# EAGLE design Extension board R.Pi ver. 1.00 (EAGLE 6.1)
Master board. Prototype version 1.0
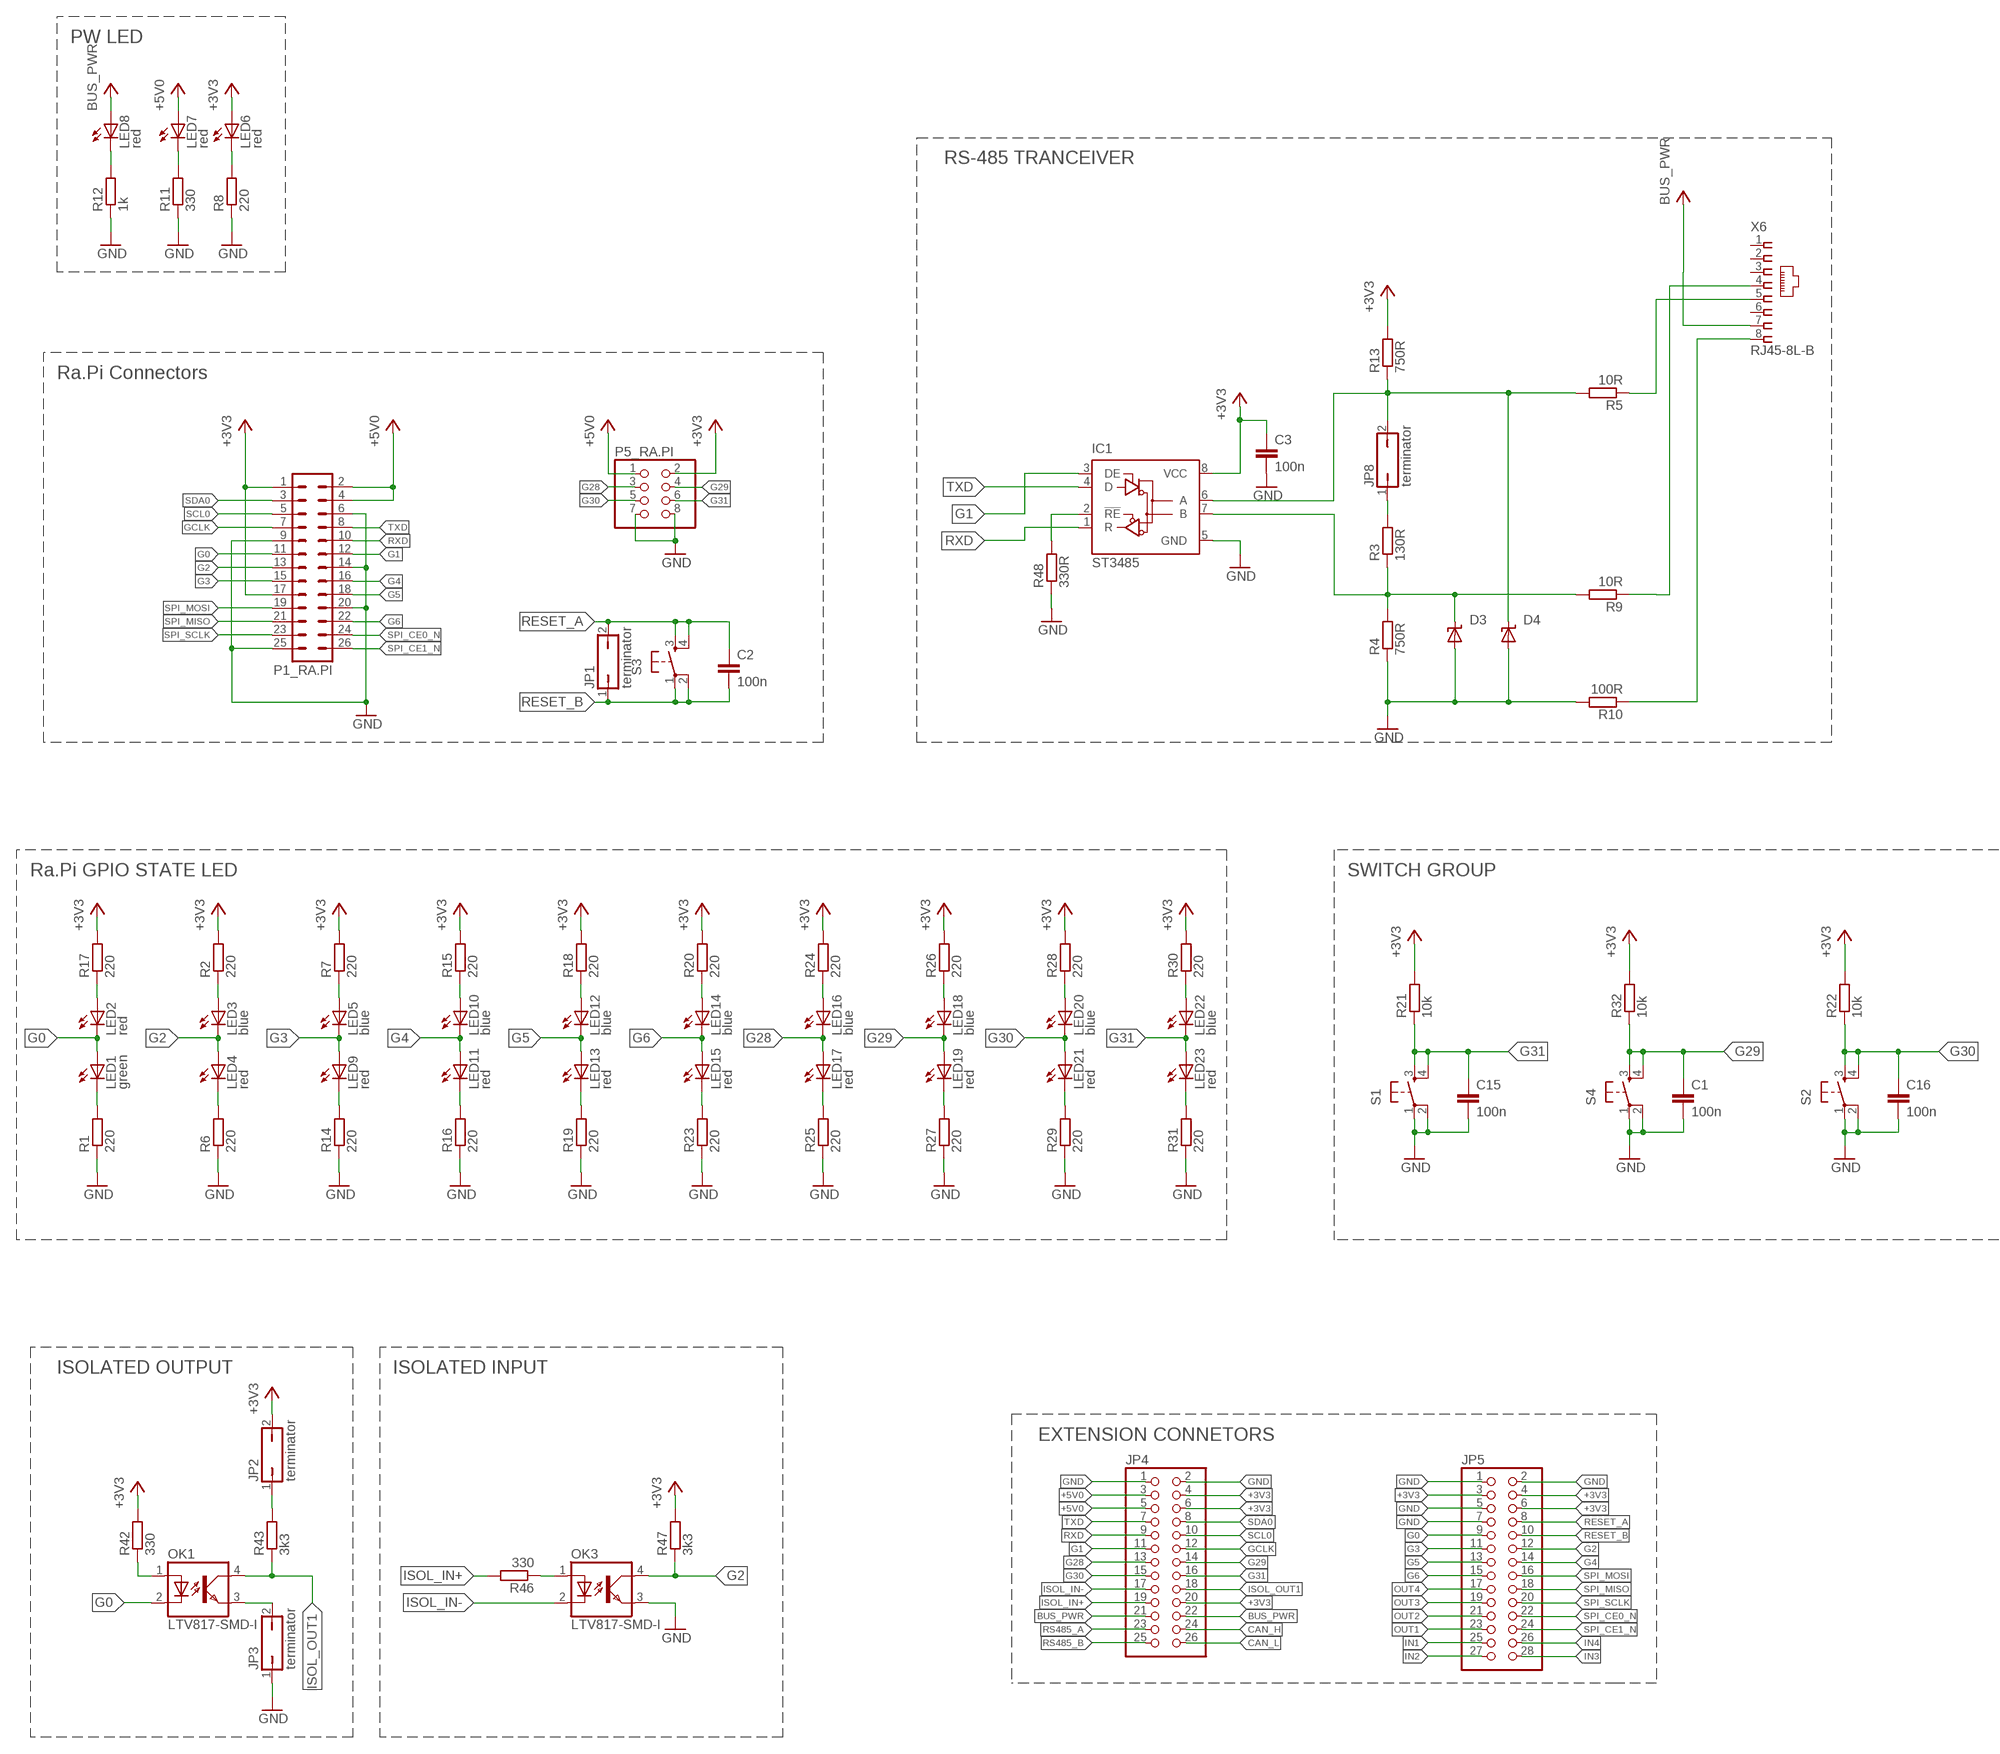
[diagram p0: schematic, sheet 1, part 1 of 2]
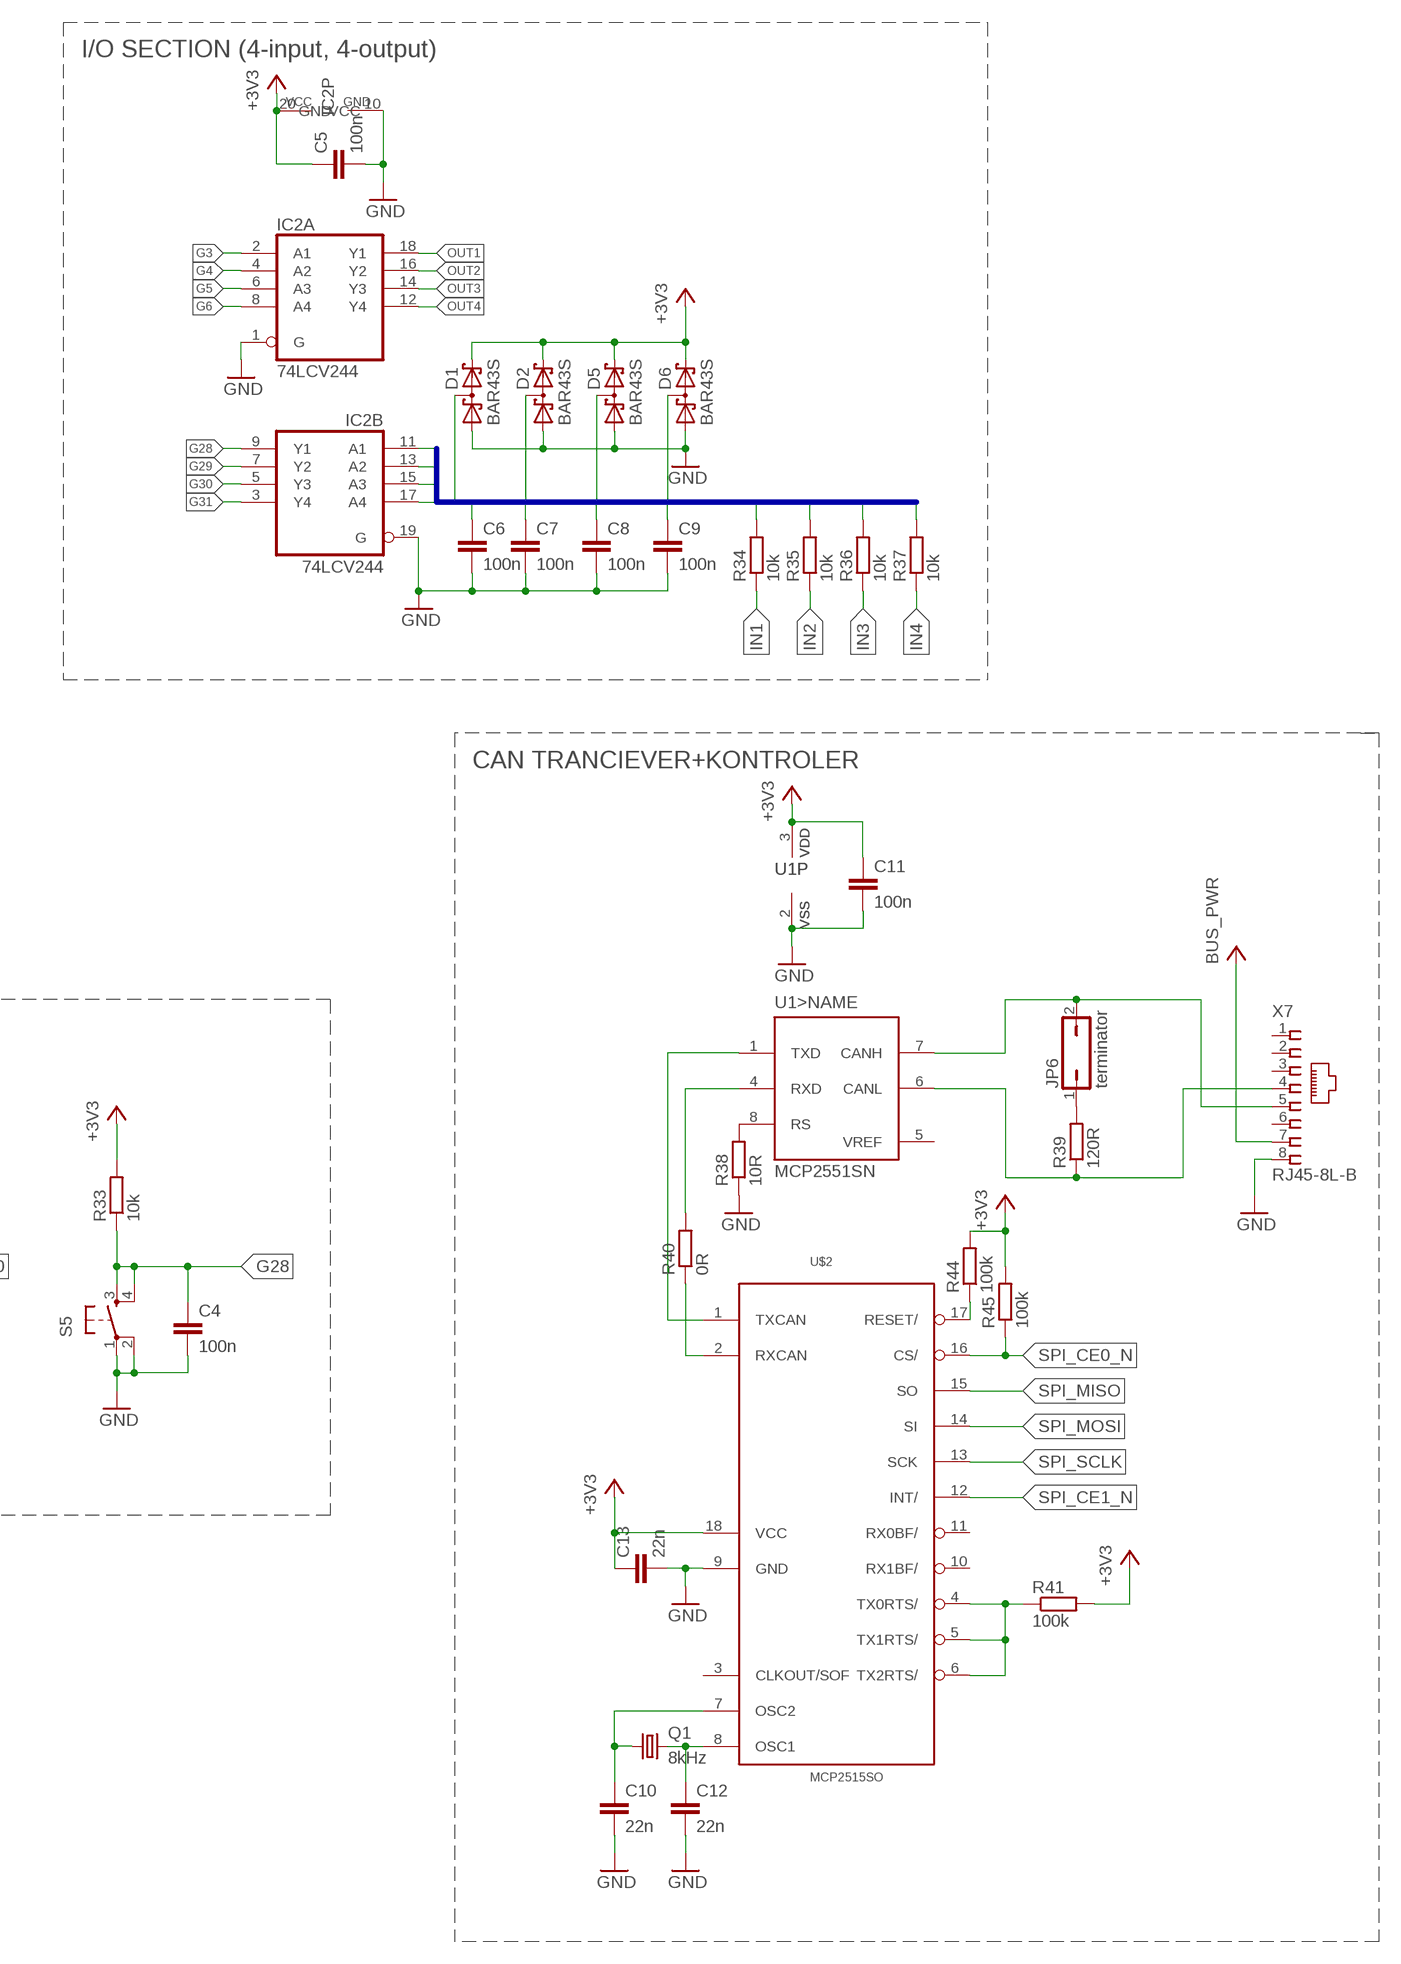
[diagram p1: schematic, sheet 1, part 2 of 2]

## Parts
C1  100n  C-EUC0805  [C0805]
C2  100n  C-EUC0805  [C0805]
C3  100n  C-EUC0805  [C0805]
C4  100n  C-EUC0805  [C0805]
C5  100n  C-EUC0805  [C0805]
C6  100n  C-EUC0805  [C0805]
C7  100n  C-EUC0805  [C0805]
C8  100n  C-EUC0805  [C0805]
C9  100n  C-EUC0805  [C0805]
C10  22n  C-EUC0805  [C0805]
C11  100n  C-EUC0805  [C0805]
C12  22n  C-EUC0805  [C0805]
C13  22n  C-EUC0805  [C0805]
C15  100n  C-EUC0805  [C0805]
C16  100n  C-EUC0805  [C0805]
D1  BAR43S  BAT54S  [SOT23]
D2  BAR43S  BAT54S  [SOT23]
D3  SUPPRESSOR-SMBJ  [SMBJ]
D4  SUPPRESSOR-SMBJ  [SMBJ]
D5  BAR43S  BAT54S  [SOT23]
D6  BAR43S  BAT54S  [SOT23]
IC1  ST3485  75176AD  [D_R-PDSO-G8]
IC2  74LCV244  74244TSSOP  [TSSOP20]
JP1  terminator  JP1Q  [JP1]
JP2  terminator  JP1Q  [JP1]
JP3  terminator  JP1Q  [JP1]
JP4  PINHD-2X13  [2X13]
JP5  PINHD-2X14  [2X14]
JP6  terminator  JP1Q  [JP1]
JP8  terminator  JP1Q  [JP1]
LED1  green  LEDSML0805  [SML0805]
LED2  red  LEDSML0805  [SML0805]
LED3  blue  LEDSML0805  [SML0805]
LED4  red  LEDSML0805  [SML0805]
LED5  blue  LEDSML0805  [SML0805]
LED6  red  LEDSML0805  [SML0805]
LED7  red  LEDSML0805  [SML0805]
LED8  red  LEDSML0805  [SML0805]
LED9  red  LEDSML0805  [SML0805]
LED10  blue  LEDSML0805  [SML0805]
LED11  red  LEDSML0805  [SML0805]
LED12  blue  LEDSML0805  [SML0805]
LED13  red  LEDSML0805  [SML0805]
LED14  blue  LEDSML0805  [SML0805]
LED15  red  LEDSML0805  [SML0805]
LED16  blue  LEDSML0805  [SML0805]
LED17  red  LEDSML0805  [SML0805]
LED18  blue  LEDSML0805  [SML0805]
LED19  red  LEDSML0805  [SML0805]
LED20  blue  LEDSML0805  [SML0805]
LED21  red  LEDSML0805  [SML0805]
LED22  blue  LEDSML0805  [SML0805]
LED23  red  LEDSML0805  [SML0805]
OK1  LTV817-SMD-I  LTV816S  [SMD4]
OK3  LTV817-SMD-I  LTV816S  [SMD4]
P1_RA.PI  MA13-2  [MA13-2]
P5_RA.PI  PINHD-2X4  [2X04]
Q1  8kHz  CRYSTALHC49UP  [HC49UP]
R1  220  R-EU_M0805  [M0805]
R2  220  R-EU_M0805  [M0805]
R3  130R  R-EU_M0805  [M0805]
R4  750R  R-EU_M0805  [M0805]
R5  10R  R-EU_M0805  [M0805]
R6  220  R-EU_M0805  [M0805]
R7  220  R-EU_M0805  [M0805]
R8  220  R-EU_M0805  [M0805]
R9  10R  R-EU_M0805  [M0805]
R10  100R  R-EU_M0805  [M0805]
R11  330  R-EU_M0805  [M0805]
R12  1k  R-EU_M0805  [M0805]
R13  750R  R-EU_M0805  [M0805]
R14  220  R-EU_M0805  [M0805]
R15  220  R-EU_M0805  [M0805]
R16  220  R-EU_M0805  [M0805]
R17  220  R-EU_M0805  [M0805]
R18  220  R-EU_M0805  [M0805]
R19  220  R-EU_M0805  [M0805]
R20  220  R-EU_M0805  [M0805]
R21  10k  R-EU_M0805  [M0805]
R22  10k  R-EU_M0805  [M0805]
R23  220  R-EU_M0805  [M0805]
R24  220  R-EU_M0805  [M0805]
R25  220  R-EU_M0805  [M0805]
R26  220  R-EU_M0805  [M0805]
R27  220  R-EU_M0805  [M0805]
R28  220  R-EU_M0805  [M0805]
R29  220  R-EU_M0805  [M0805]
R30  220  R-EU_M0805  [M0805]
R31  220  R-EU_M0805  [M0805]
R32  10k  R-EU_M0805  [M0805]
R33  10k  R-EU_M0805  [M0805]
R34  10k  R-EU_M0805  [M0805]
R35  10k  R-EU_M0805  [M0805]
R36  10k  R-EU_M0805  [M0805]
R37  10k  R-EU_M0805  [M0805]
R38  10R  R-EU_M0805  [M0805]
R39  120R  R-EU_M0805  [M0805]
R40  0R  R-EU_M0805  [M0805]
R41  100k  R-EU_M0805  [M0805]
R42  330  R-EU_M0805  [M0805]
R43  3k3  R-EU_M0805  [M0805]
R44  100k  R-EU_M0805  [M0805]
R45  100k  R-EU_M0805  [M0805]
R46  330  R-EU_M0805  [M0805]
R47  3k3  R-EU_M0805  [M0805]
R48  330R  R-EU_M0805  [M0805]
S1  SPARKFUN_TAC_SWITCHSMD  [SPARKFUN_TACTILE_SWITCH_SMD]
S2  SPARKFUN_TAC_SWITCHSMD  [SPARKFUN_TACTILE_SWITCH_SMD]
S3  SPARKFUN_TAC_SWITCHSMD  [SPARKFUN_TACTILE_SWITCH_SMD]
S4  SPARKFUN_TAC_SWITCHSMD  [SPARKFUN_TACTILE_SWITCH_SMD]
S5  SPARKFUN_TAC_SWITCHSMD  [SPARKFUN_TACTILE_SWITCH_SMD]
U1  MCP2551SN  [SO-08]
U$2  MCP2515SO  [SO18L]
X6  RJ45-8L-B  [RJ45-NO-SHIELD]
X7  RJ45-8L-B  [RJ45-NO-SHIELD]

## Nets
+3V3: C3.1 C5.1 C11.1 C13.1 D1.2(C2) D2.2(C2) D5.2(C2) D6.2(C2) IC1.8(VCC) IC2.20(P:VCC) JP2.2 JP4.4 JP4.6 JP4.20 JP5.3 JP5.4 JP5.6 LED6.A P1_RA.PI.1 P1_RA.PI.17 P5_RA.PI.2 R2.2 R7.2 R13.2 R15.2 R17.2 R18.2 R20.2 R21.2 R22.2 R24.2 R26.2 R28.2 R30.2 R32.2 R33.2 R41.2 R42.2 R44.2 R45.2 R47.2 U1.3(P:VDD) U$2.18(VCC)
+5V0: JP4.3 JP4.5 LED7.A P1_RA.PI.2 P1_RA.PI.4 P5_RA.PI.1
BUS_PWR: JP4.21 JP4.22 LED8.A X6.7 X7.7
CAN_H: JP4.24 JP6.2 U1.7(>NAME:CANH) X7.5
CAN_L: JP4.26 R39.1 U1.6(>NAME:CANL) X7.4
G0: JP5.9 LED1.A LED2.C OK1.2(C) P1_RA.PI.11
G1: IC1.3(DE) JP4.11 P1_RA.PI.12
G2: JP5.12 LED3.C LED4.A OK3.4(COL) P1_RA.PI.13 R47.1
G3: IC2.2(A:A1) JP5.11 LED5.C LED9.A P1_RA.PI.15
G4: IC2.4(A:A2) JP5.14 LED10.C LED11.A P1_RA.PI.16
G5: IC2.6(A:A3) JP5.13 LED12.C LED13.A P1_RA.PI.18
G6: IC2.8(A:A4) JP5.15 LED14.C LED15.A P1_RA.PI.22
G28: C4.1 IC2.9(B:Y1) JP4.13 LED16.C LED17.A P5_RA.PI.3 R33.1 S5.3 S5.4
G29: C1.1 IC2.7(B:Y2) JP4.14 LED18.C LED19.A P5_RA.PI.4 R32.1 S4.3 S4.4
G30: C16.1 IC2.5(B:Y3) JP4.15 LED20.C LED21.A P5_RA.PI.5 R22.1 S2.3 S2.4
G31: C15.1 IC2.3(B:Y4) JP4.16 LED22.C LED23.A P5_RA.PI.6 R21.1 S1.3 S1.4
GCLK: JP4.12 P1_RA.PI.7
GND: C1.2 C3.2 C4.2 C5.2 C6.2 C7.2 C8.2 C9.2 C10.2 C11.2 C12.2 C13.2 C15.2 C16.2 D1.1(A1) D2.1(A1) D3.A D4.A D5.1(A1) D6.1(A1) IC1.5(GND) IC2.1(A:G) IC2.10(P:GND) IC2.19(B:G) JP3.1 JP4.1 JP4.2 JP5.1 JP5.2 JP5.5 JP5.7 OK3.3(EMIT) P1_RA.PI.6 P1_RA.PI.9 P1_RA.PI.14 P1_RA.PI.20 P1_RA.PI.25 P5_RA.PI.7 P5_RA.PI.8 R1.1 R4.1 R6.1 R8.1 R10.2 R11.1 R12.1 R14.1 R16.1 R19.1 R23.1 R25.1 R27.1 R29.1 R31.1 R38.1 R48.1 S1.1 S1.2 S2.1 S2.2 S4.1 S4.2 S5.1 S5.2 U1.2(P:VSS) U$2.9(GND) X7.8
GND_RS485: R10.1 X6.8
IN1: JP5.25 R34.1
IN2: JP5.27 R35.1
IN3: JP5.28 R36.1
IN4: JP5.26 R37.1
IN_1: C6.1 D1.3(C1A2) IC2.11(B:A1) R34.2
IN_2: C7.1 D2.3(C1A2) IC2.13(B:A2) R35.2
IN_3: C8.1 D5.3(C1A2) IC2.15(B:A3) R36.2
IN_4: C9.1 D6.3(C1A2) IC2.17(B:A4) R37.2
ISOL_IN+: JP4.19 R46.2
ISOL_IN-: JP4.17 OK3.2(C)
ISOL_OUT1: JP4.18 OK1.4(COL) R43.1
N$1: LED2.A R17.1
N$2: R38.2 U1.8(>NAME:RS)
N$3: R40.1 U$2.2(RXCAN)
N$4: D3.C IC1.7(B) R3.1 R4.2 R9.2
N$5: LED1.C R1.2
N$6: LED6.C R8.2
N$7: LED7.C R11.2
N$8: LED8.C R12.2
N$9: LED3.A R2.1
N$10: LED4.C R6.2
N$11: LED5.A R7.1
N$12: LED9.C R14.2
N$13: LED10.A R15.1
N$14: LED11.C R16.2
N$15: JP8.1 R3.2
N$16: LED12.A R18.1
N$17: LED13.C R19.2
N$18: LED14.A R20.1
N$19: LED15.C R23.2
N$20: LED16.A R24.1
N$21: LED17.C R25.2
N$22: LED18.A R26.1
N$23: LED19.C R27.2
N$24: LED20.A R28.1
N$25: LED21.C R29.2
N$26: LED22.A R30.1
N$27: LED23.C R31.2
N$28: R40.2 U1.4(>NAME:RXD)
N$29: U1.1(>NAME:TXD) U$2.1(TXCAN)
N$30: JP6.1 R39.2
N$31: C12.1 Q1.2 U$2.8(OSC1)
N$32: C10.1 Q1.1 U$2.7(OSC2)
N$33: JP3.2 OK1.3(EMIT)
N$34: OK1.1(A) R42.1
N$35: OK3.1(A) R46.1
N$36: JP2.1 R43.2
N$37: R41.1 U$2.4(TX0RTS/) U$2.5(TX1RTS/) U$2.6(TX2RTS/)
N$38: R44.1 U$2.17(RESET/)
N$39: IC1.2(!RE) R48.2
OUT1: IC2.18(A:Y1) JP5.23
OUT2: IC2.16(A:Y2) JP5.21
OUT3: IC2.14(A:Y3) JP5.19
OUT4: IC2.12(A:Y4) JP5.17
RESET_A: C2.1 JP1.2 JP5.8 S3.3 S3.4
RESET_B: C2.2 JP1.1 JP5.10 S3.1 S3.2
RS485_A: JP4.23 R5.1 X6.5
RS485_A2: D4.C IC1.6(A) JP8.2 R5.2 R13.1
RS485_B: JP4.25 R9.1 X6.4
RXD: IC1.1(R) JP4.9 P1_RA.PI.10
SCL0: JP4.10 P1_RA.PI.5
SDA0: JP4.8 P1_RA.PI.3
SPI_CE0_N: JP5.22 P1_RA.PI.24 R45.1 U$2.16(CS/)
SPI_CE1_N: JP5.24 P1_RA.PI.26 U$2.12(INT/)
SPI_MISO: JP5.18 P1_RA.PI.21 U$2.15(SO)
SPI_MOSI: JP5.16 P1_RA.PI.19 U$2.14(SI)
SPI_SCLK: JP5.20 P1_RA.PI.23 U$2.13(SCK)
TXD: IC1.4(D) JP4.7 P1_RA.PI.8
Unconnected: U$2.3(CLKOUT/SOF) U$2.10(RX1BF/) U$2.11(RX0BF/) X6.1 X6.2 X6.3 X6.6 X7.1 X7.2 X7.3 X7.6

## Buses
IN_1,IN_2,IN_3,IN_4

## Notes on the sheet
- PW LED
- I/O SECTION (4-input, 4-output)
- RS-485 TRANCEIVER
- Ra.Pi Connectors
- CAN TRANCIEVER+KONTROLER
- Ra.Pi GPIO STATE LED | SWITCH GROUP
- ISOLATED OUTPUT | ISOLATED INPUT
- EXTENSION CONNETORS

## Power pins joined to a net without a drawn wire
VREF: U1.5(>NAME:VREF)

## Library data of the parts
C1-C13 C15 C16 = rcl:C-EU: CAPACITOR, European symbol
D1 D2 D5 D6 = diode:BAT54S: Schottky Diodes Pin connection corrected 2011-05-04 Source: Fairchild .. BAT54.pdf
D3 D4 = diode:SUPPRESSOR-: Suppressor diode
IC1 = 751xx:75176A: DIFFERENTIAL BUS TRANSCEIVER Source: http://focus.ti.com/lit/ds/symlink/sn75176a.pdf
IC2 = 74xx-eu:74*244: Octal BUFFER and LINE DRIVER, 3-state
JP1-JP3 JP6 JP8 = jumper:JP1Q: JUMPER
JP4 = pinhead:PINHD-2X13: PIN HEADER
JP5 = pinhead:PINHD-2X14: PIN HEADER
LED1-LED23 = led:LED: LED OSRAM: - CHIPLED LG R971, LG N971, LY N971, LG Q971, LY Q971, LO R971, LY R971 LH N974, LH R974 LS Q976, LO Q976, LY Q976 LO Q996 - Hyper CHIPLED LW Q18S LB Q993, LB Q99A, LB R99A - SideLED LS A670, LO A670, LY A670, LG A670, LP A670 LB A673, LV A673, LT A673, LW A673 LH A674 LY A675 LS A676, LA A676, LO A676, LY A676, LW A676 LS A679, LY A679, LG A679 - Hyper Micro SIDELED® LS Y876, LA Y876, LO Y876, LY Y876 LT Y87S - SmartLED LW L88C, LW L88S LB L89C, LB L89S, LG L890 LS L89K, LO L89K, LY L89K LS L896, LA L896, LO L896, LY L896 - TOPLED LS T670, LO T670, LY T670, LG T670, LP T670 LSG T670, LSP T670, LSY T670, LOP T670, LYG T670 LG T671, LOG T671, LSG T671 LB T673, LV T673, LT T673, LW T673 LH T674 LS T676, LA T676, LO T676, LY T676, LB T676, LH T676, LSB T676, LW T676 LB T67C, LV T67C, LT T67C, LS T67K, LO T67K, LY T67K, LW E67C LS E67B, LA E67B, LO E67B, LY E67B, LB E67C, LV E67C, LT E67C LW T67C LS T679, LY T679, LG T679 LS T770, LO T770, LY T770, LG T770, LP T770 LB T773, LV T773, LT T773, LW T773 LH T774 LS E675, LA E675, LY E675, LS T675 LS T776, LA T776, LO T776, LY T776, LB T776 LHGB T686 LT T68C, LB T68C - Hyper Mini TOPLED® LB M676 - Mini TOPLED Santana® LG M470 LS M47K, LO M47K, LY M47K Source: http://www.osram.convergy.de LUXEON: - LUMILED® LXK2-PW12-R00, LXK2-PW12-S00, LXK2-PW14-U00, LXK2-PW14-V00 LXK2-PM12-R00, LXK2-PM12-S00, LXK2-PM14-U00 LXK2-PE12-Q00, LXK2-PE12-R00, LXK2-PE12-S00, LXK2-PE14-T00, LXK2-PE14-U00 LXK2-PB12-K00, LXK2-PB12-L00, LXK2-PB12-M00, LXK2-PB14-N00, LXK2-PB14-P00, LXK2-PB14-Q00 LXK2-PR12-L00, LXK2-PR12-M00, LXK2-PR14-Q00, LXK2-PR14-R00 LXK2-PD12-Q00, LXK2-PD12-R00, LXK2-PD12-S00 LXK2-PH12-R00, LXK2-PH12-S00 LXK2-PL12-P00, LXK2-PL12-Q00, LXK2-PL12-R00 Source: www.luxeon.com KINGBRIGHT: KA-3528ASYC Source: www.kingbright.com
OK1 OK3 = optocoupler:LTV816: OPTO COUPLER Source: LITEON, LTV816.pdf; OC_FARNELL: unknown; OC_NEWARK: unknown
P1_RA.PI = con-lstb:MA13-2: PIN HEADER; OC_FARNELL: unknown; OC_NEWARK: unknown
P5_RA.PI = pinhead:PINHD-2X4: PIN HEADER
Q1 = crystal:CRYSTAL: CRYSTAL; OC_FARNELL: unknown; OC_NEWARK: unknown
R1-R48 = rcl:R-EU_: RESISTOR, European symbol
S1-S5 = Nokia-Breakout-v14:SPARKFUN_TAC_SWITCH: Momentary Switch Button commonly used for reset or general input. Spark Fun Electronics SKU : COM-00097
U1 = microchip_can:MCP2551: High Speed CAN tranceiver
U$2 = MCP2515_MT:MCP2515*: MCP2515 Standalone CAN-Controller by Microchip Eagle-Lib. by MartinThomas
X6 X7 = con-tycoelectronics:RJ45: CORCOM Modular RJ Jacks No Shield Source: www.tycoelectronics.com .. ENG_DS_1654001_1099_RJ_L_0507.pdf; MF: TYCO ELECTRONICS; MPN: RJ45-8L-B; OC_FARNELL: 1279843; OC_NEWARK: 52K4445

## Board
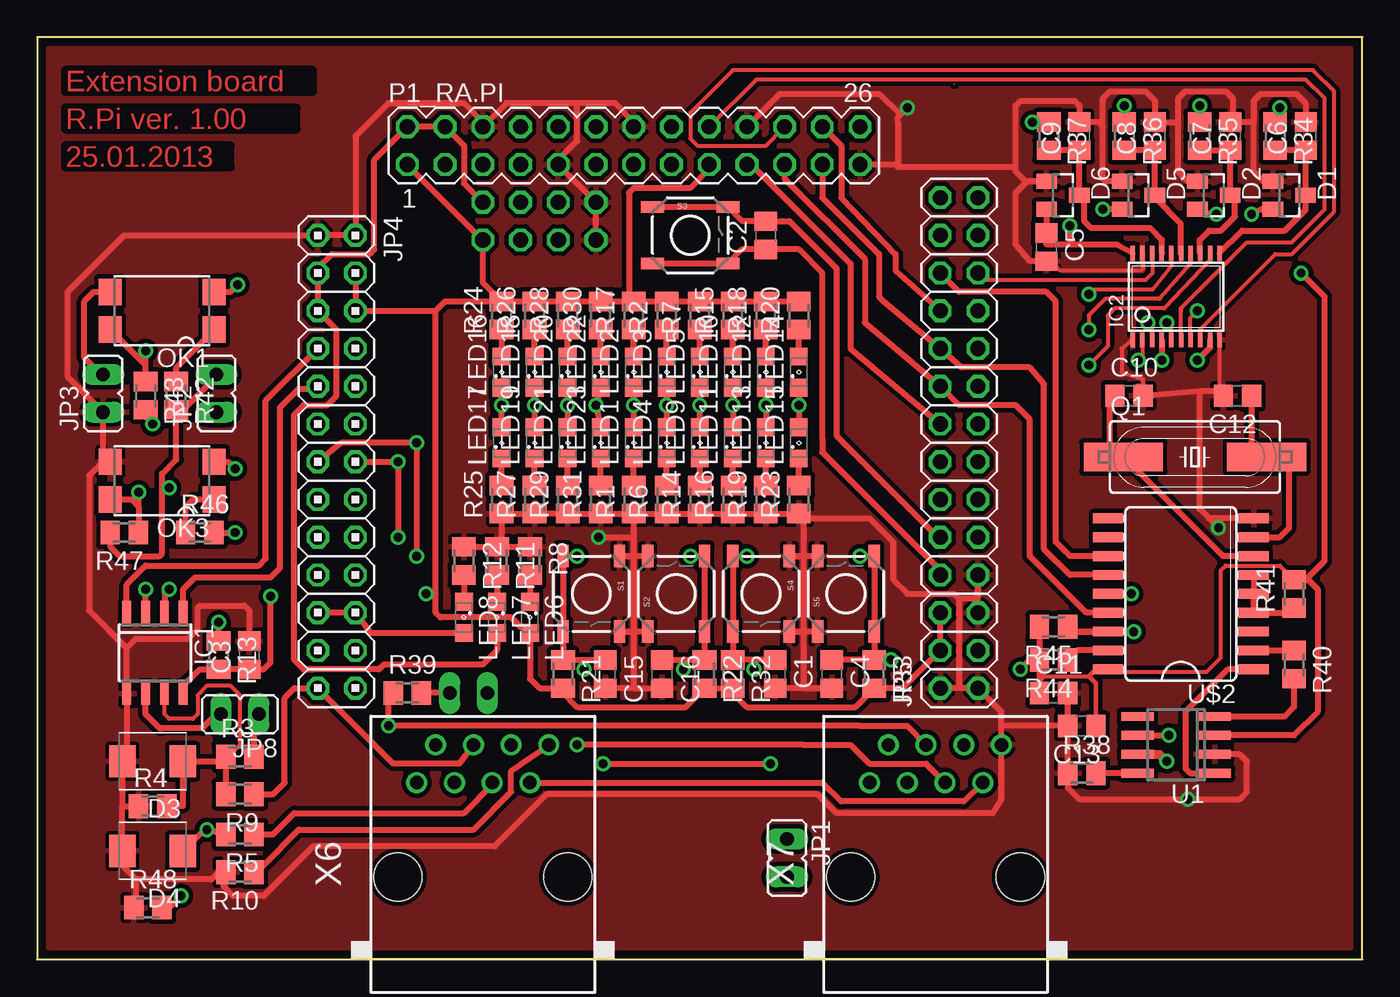
[diagram p2: board, top side]
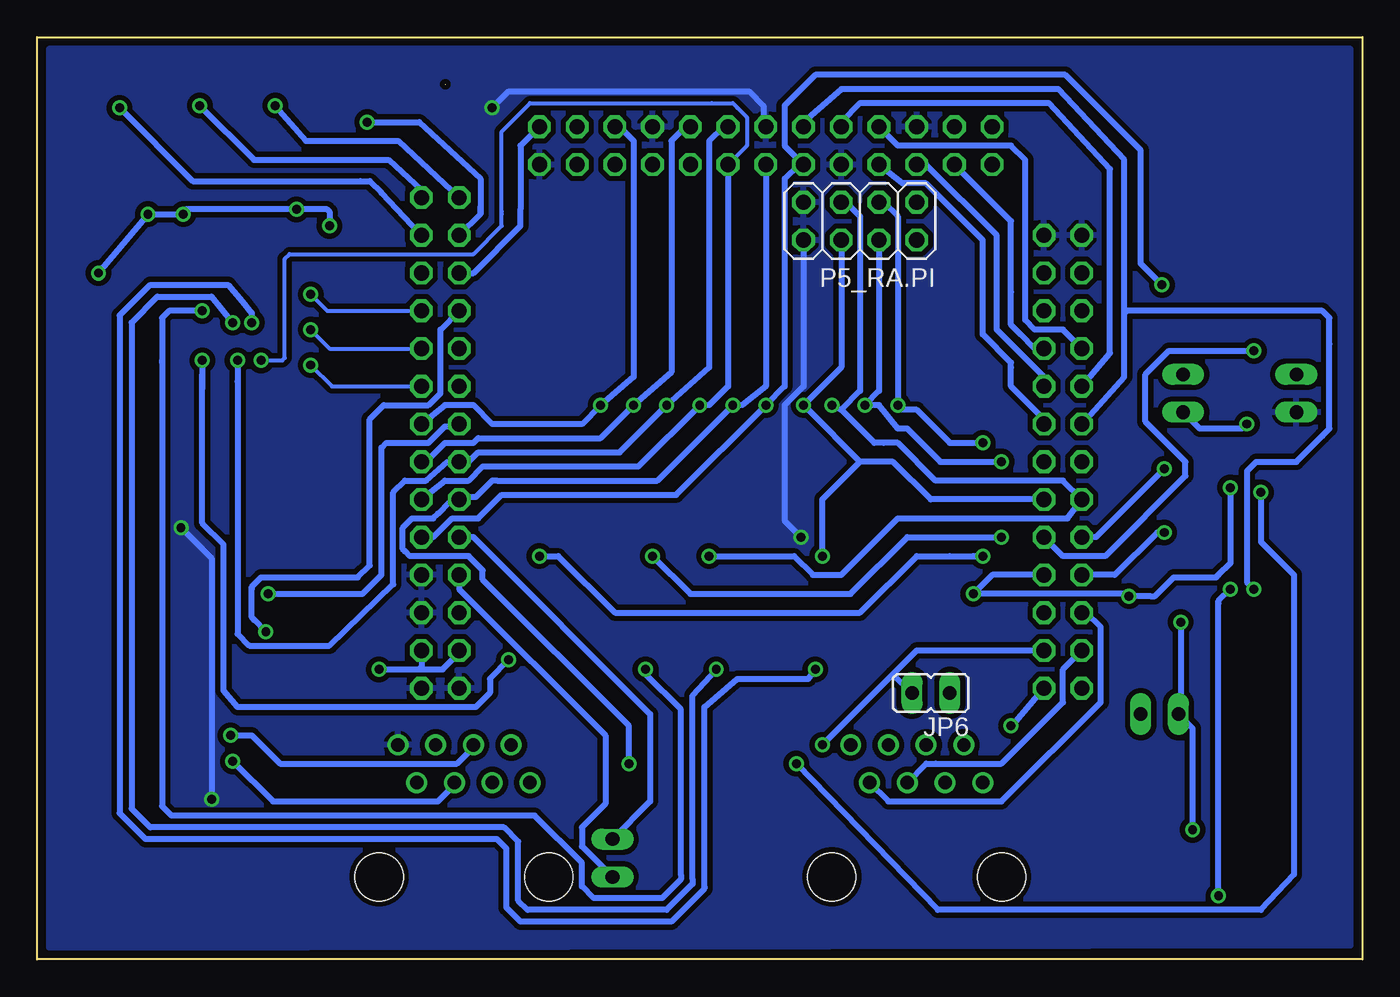
[diagram p3: board, bottom side, seen from below]

Size 89.22 x 62.07 mm. Coordinates in mm from the lower left corner, seen from the top.
Outline: 61.75,58.9 61.73,58.9
Outline: 0,62.07 0,0 89.22,0 89.22,62.07 0,62.07
Copper layers (1*16): Top 0.035mm / dielectric 1.5mm / Bottom 0.035mm
Design rules: minimum track width 10mil, minimum drill 24mil, track to track 6mil, track to pad 6mil, pad to pad 6mil, via to via 6mil, smd to smd 1mil, copper to edge 1mil, drill to drill 1mil, minimum pad ring 10mil, minimum via ring 8mil, stop-mask expansion 0mil, vias tented up to drill 0mil, thermal gap 10mil

### Footprints (pad centres in the part's own frame; a part is rotated, then mirrored left to right if it is on the bottom)
C0805 = smd 1.3 x 1.5: 1 -0.95,0; 2 0.95,0
SOT23 = smd 1 x 1.4: 1 -0.95,-1.1; 2 0.95,-1.1; 3 0,1.1
SMBJ = smd 1.78 x 2.16: A 2.04,0; C -2.03,0
D_R-PDSO-G8 = smd 0.6 x 1.5: 1 -1.905,-2.75; 2 -0.635,-2.75; 3 0.635,-2.75; 4 1.905,-2.75; 5 1.905,2.75; 6 0.635,2.75; 7 -0.635,2.75; 8 -1.905,2.75
TSSOP20 = smd 0.305 x 0.991: 1 -2.925,-2.918; 2 -2.275,-2.918; 3 -1.625,-2.918; 4 -0.975,-2.918; 5 -0.325,-2.918; 6 0.325,-2.918; 7 0.975,-2.918; 8 1.625,-2.918; 9 2.275,-2.918; 10 2.925,-2.918; 11 2.925,2.918; 12 2.275,2.918; 13 1.625,2.918; 14 0.975,2.918; 15 0.325,2.918; 16 -0.325,2.918; 17 -0.975,2.918; 18 -1.625,2.918; 19 -2.275,2.918; 20 -2.925,2.918
JP1 = drill 0.914 long: 1 0,-1.27; 2 0,1.27
2X13 = drill 1.016 octagon: 1 -15.24,-1.27; 2 -15.24,1.27; 3 -12.7,-1.27; 4 -12.7,1.27; 5 -10.16,-1.27; 6 -10.16,1.27; 7 -7.62,-1.27; 8 -7.62,1.27; 9 -5.08,-1.27; 10 -5.08,1.27; 11 -2.54,-1.27; 12 -2.54,1.27; 13 0,-1.27; 14 0,1.27; 15 2.54,-1.27; 16 2.54,1.27; 17 5.08,-1.27; 18 5.08,1.27; 19 7.62,-1.27; 20 7.62,1.27; 21 10.16,-1.27; 22 10.16,1.27; 23 12.7,-1.27; 24 12.7,1.27; 25 15.24,-1.27; 26 15.24,1.27
2X14 = drill 1.016 octagon: 1 -16.51,-1.27; 2 -16.51,1.27; 3 -13.97,-1.27; 4 -13.97,1.27; 5 -11.43,-1.27; 6 -11.43,1.27; 7 -8.89,-1.27; 8 -8.89,1.27; 9 -6.35,-1.27; 10 -6.35,1.27; 11 -3.81,-1.27; 12 -3.81,1.27; 13 -1.27,-1.27; 14 -1.27,1.27; 15 1.27,-1.27; 16 1.27,1.27; 17 3.81,-1.27; 18 3.81,1.27; 19 6.35,-1.27; 20 6.35,1.27; 21 8.89,-1.27; 22 8.89,1.27; 23 11.43,-1.27; 24 11.43,1.27; 25 13.97,-1.27; 26 13.97,1.27; 27 16.51,-1.27; 28 16.51,1.27
SML0805 = smd 1.2 x 1.2: A 1.05,0; C -1.05,0
SMD4 = smd 1.78 x 1.55: 1 -1.27,-3.5; 2 1.27,-3.5; 3 1.27,3.5; 4 -1.27,3.5
MA13-2 = drill 1.016 octagon: 1 -15.24,-1.27; 2 -15.24,1.27; 3 -12.7,-1.27; 4 -12.7,1.27; 5 -10.16,-1.27; 6 -10.16,1.27; 7 -7.62,-1.27; 8 -7.62,1.27; 9 -5.08,-1.27; 10 -5.08,1.27; 11 -2.54,-1.27; 12 -2.54,1.27; 13 0,-1.27; 14 0,1.27; 15 2.54,-1.27; 16 2.54,1.27; 17 5.08,-1.27; 18 5.08,1.27; 19 7.62,-1.27; 20 7.62,1.27; 21 10.16,-1.27; 22 10.16,1.27; 23 12.7,-1.27; 24 12.7,1.27; 25 15.24,-1.27; 26 15.24,1.27
2X04 = drill 1.016 octagon: 1 -3.81,-1.27; 2 -3.81,1.27; 3 -1.27,-1.27; 4 -1.27,1.27; 5 1.27,-1.27; 6 1.27,1.27; 7 3.81,-1.27; 8 3.81,1.27
HC49UP = smd 5.334 x 1.93: 1 -4.826,0; 2 4.826,0
M0805 = smd 1.3 x 1.6: 1 -0.95,0; 2 0.95,0
SPARKFUN_TACTILE_SWITCH_SMD = smd 1.524 x 0.762: 1 -2.54,1.905; 2 2.54,1.905; 3 -2.54,-1.905; 4 2.54,-1.905
SO-08 = smd 0.6 x 2.2: 1 -1.905,-2.6; 2 -0.635,-2.6; 3 0.635,-2.6; 4 1.905,-2.6; 5 1.905,2.6; 6 0.635,2.6; 7 -0.635,2.6; 8 -1.905,2.6
SO18L = smd 0.66 x 2.032: 1 -5.08,-4.902; 2 -3.81,-4.902; 3 -2.54,-4.902; 4 -1.27,-4.902; 5 0,-4.902; 6 1.27,-4.902; 7 2.54,-4.902; 8 3.81,-4.902; 9 5.08,-4.902; 10 5.08,4.902; 11 3.81,4.902; 12 2.54,4.902; 13 1.27,4.902; 14 0,4.902; 15 -1.27,4.902; 16 -2.54,4.902; 17 -3.81,4.902; 18 -5.08,4.902
RJ45-NO-SHIELD = drill 0.9 pad 1.4: 1 -4.445,6.35; 2 -3.175,8.89; 3 -1.905,6.35; 4 -0.635,8.89; 5 0.635,6.35; 6 1.905,8.89; 7 3.175,6.35; 8 4.445,8.89 | hole 3.251: -5.715,0; 5.715,0

### Placement (x,y rotation side)
C1  49.69,19.21 270 top
C2  49.05,48.74 90 top
C3  14.29,20.48 90 top
C4  53.5,19.21 270 top
C5  67.94,47.94 270 top
C6  85.41,55.4 90 top
C7  80.33,55.4 90 top
C8  75.25,55.4 90 top
C9  70.17,55.4 90 top
C10  73.5,37.94 0 top
C11  68.42,17.94 0 top
C12  80.8,37.94 180 top
C13  70.33,15.72 180 top
C15  38.26,19.21 270 top
C16  42.07,19.21 270 top
D1  84.3,51.44 270 top
D2  79.22,51.44 270 top
D3  7.78,13.34 180 top
D4  7.78,7.3 180 top
D5  74.14,51.44 270 top
D6  69.06,51.44 270 top
IC1  7.94,20.64 180 top
IC2  76.68,44.61 0 top
JP1  50.48,6.83 180 top
JP2  12.06,38.1 0 top
JP3  4.44,38.1 0 top
JP4  20.16,33.5 270 top
JP5  62.07,34.77 90 top
JP6  29.05,17.94 90 bottom
JP8  13.65,16.51 90 top
LED1  40.16,34.77 90 top
LED2  40.16,39.53 90 top
LED3  42.39,39.53 90 top
LED4  42.39,34.77 90 top
LED5  44.61,39.53 90 top
LED6  33.18,23.02 270 top
LED7  30.96,23.02 270 top
LED8  28.73,23.02 270 top
LED9  44.61,34.77 90 top
LED10  46.83,39.53 90 top
LED11  46.83,34.77 90 top
LED12  49.05,39.53 90 top
LED13  49.05,34.77 90 top
LED14  51.28,39.53 90 top
LED15  51.28,34.77 90 top
LED16  31.27,39.53 90 top
LED17  31.27,34.77 90 top
LED18  33.5,39.53 90 top
LED19  33.5,34.77 90 top
LED20  35.72,39.53 90 top
LED21  35.72,34.77 90 top
LED22  37.94,39.53 90 top
LED23  37.94,34.77 90 top
OK1  8.41,43.66 90 top
OK3  8.41,32.23 90 top
P1_RA.PI  40.16,54.77 0 top
P5_RA.PI  33.81,49.69 180 bottom
Q1  77.95,33.81 0 top
R1  40.16,30.96 90 top
R2  42.39,43.34 90 top
R3  13.65,13.65 0 top
R4  7.78,10.32 0 top
R5  13.65,8.41 180 top
R6  42.39,30.96 90 top
R7  44.61,43.34 90 top
R8  33.18,26.83 270 top
R9  13.65,11.11 180 top
R10  13.65,5.87 180 top
R11  30.96,26.83 270 top
R12  28.73,26.83 270 top
R13  12.22,20.48 270 top
R14  44.61,30.96 90 top
R15  46.83,43.34 90 top
R16  46.83,30.96 90 top
R17  40.16,43.34 90 top
R18  49.05,43.34 90 top
R19  49.05,30.96 90 top
R20  51.28,43.34 90 top
R21  35.4,19.21 270 top
R22  44.93,19.21 270 top
R23  51.28,30.96 90 top
R24  31.27,43.34 90 top
R25  31.27,30.96 90 top
R26  33.5,43.34 90 top
R27  33.5,30.96 90 top
R28  35.72,43.34 90 top
R29  35.72,30.96 90 top
R30  37.94,43.34 90 top
R31  37.94,30.96 90 top
R32  46.83,19.21 270 top
R33  56.36,19.21 270 top
R34  83.34,55.4 270 top
R35  78.26,55.4 270 top
R36  73.18,55.4 270 top
R37  68.1,55.4 270 top
R38  70.33,12.54 0 top
R39  24.92,17.94 0 top
R40  84.61,19.84 270 top
R41  84.61,24.61 90 top
R42  9.37,37.94 270 top
R43  7.3,37.94 270 top
R44  68.42,20.16 180 top
R45  68.42,22.38 180 top
R46  10.95,28.73 0 top
R47  5.87,28.73 180 top
R48  7.46,3.49 0 top
S1  37.31,24.61 270 top
S2  43.02,24.61 90 top
S3  43.97,48.74 0 top
S4  48.74,24.61 270 top
S5  54.45,24.61 90 top
U1  76.68,14.45 90 top
U$2  76.99,24.61 90 top
X6  30,5.56 0 top
X7  60.48,5.56 0 top

### Tracks (layer width: path | path; a pad name or v marks a point on that pad's centre or on a via)
+3V3  (via drill 0.6)
  Top 0.254: LED6.A 33.18,22.38 | 30.64,44.29 R26.2 | 67.79,19.05 70.8,19.05 | C13.1 71.28,18.58 70.8,19.05 | 70.8,19.05 71.12,19.37 78.74,19.37 79.69,20.32 79.69,26.19 80.01,26.51 83.66,26.51 R41.2 | R41.2 84.69,25.48 R41.2 | 67.96,48.11 67.96,48.1 68.1,48.1 | 69.53,48.26 69.37,48.1
  Top 0.305: C11.1 67.47,18.89 67.63,18.89 67.79,19.05 | U$2.18 71.28,19.53 71.12,19.37 70.8,19.05 71.28,18.58 C13.1
  Top 0.406: R2.2 R17.2 R30.2 R28.2 R26.2 R24.2 30,45.56 P5_RA.PI.2 P1_RA.PI.1 | R2.2 R7.2 R15.2 R18.2 R20.2 | LED6.A 33.18,18.89 33.81,18.26 R21.2 35.4,17.94 36.35,16.99 43.65,16.99 R22.2 R32.2 46.83,17.94 47.78,16.99 55.08,16.99 R33.2 58.26,18.26 JP5.4 JP5.6 | P1_RA.PI.17 45.24,53.18 43.97,51.91 40.16,51.91 39.85,51.59 39.85,44.29 R2.2 | 26.83,43.66 27.46,44.29 30.64,44.29 | JP4.4 JP4.6 26.83,43.66 | 33.18,22.38 32.54,22.38 31.91,23.02 27.15,23.02 26.83,23.34 26.83,24.61 | 26.83,24.61 26.83,43.66 | R41.2 85.57,25.56 86.2,24.92 86.2,16.67 84.61,15.08 U1.3 | R45.2 R44.2 | R44.2 C11.1 | R44.2 66.84,20.16 v66.2,19.53 | D6.2 67.96,48.11 C5.1 | v79.37,50.17 78.44,50.17 D2.2 | D5.2 v71.76,50.49 v71.75,50.48 | IC1.8 9.84,18.42 10.95,19.53 R13.2 C3.1 15.24,19.53 15.72,20 v15.72,24.45 | v26.19,24.61 26.83,24.61 | JP2.2 12.06,39.21 10,37.15 9.52,37.15 R42.2 | R47.2 4.92,27.78 5.56,27.15 8.25,27.15 8.41,27.31 | 8.41,27.31 8.41,32.7 9.37,33.66 R42.2 | R42.2 9.68,37.31 | 8.41,27.31 8.41,31.75 v8.89,31.75 | IC2.20 72.7,48.1 69.37,48.1 68.1,48.1 67.94,48.1 | v69.53,49.37 69.53,48.26 | 84.69,25.48 85.33,25.48 86.68,26.83 86.68,44.61 v85.09,46.2 | D1.2 82.71,50.49 82.39,50.48 v81.76,50.17 82.39,50.49 D1.2
  Bottom 0.406: v66.2,19.53 63.5,19.53 | 63.5,19.53 61.91,19.53 60.8,20.64 JP5.4 | v85.09,46.2 v81.76,50.17 v79.37,50.17 79.22,50.48 v71.75,50.48 69.69,50.48 69.53,50.32 v69.53,49.37 | JP5.3 63.34,19.69 63.5,19.53 | v8.89,31.75 8.89,26.67 | 8.89,26.67 9.68,25.88 | JP4.20 24.92,25.88 v26.19,24.61 15.87,24.61 v15.72,24.45 14.29,24.45 13.97,24.45 12.7,25.72 9.84,25.72 9.68,25.88 | 9.68,25.88 8.89,26.67
+5V0
  Top 0.406: P5_RA.PI.1 28.73,52.23 28.73,54.77 P1_RA.PI.4 P1_RA.PI.2 22.7,53.82 22.7,47.78 22.38,47.47 19.84,47.47 18.89,46.51 JP4.3 JP4.5 20.16,42.39 20.16,37.94 19.53,37.31 17.94,37.31 17.3,36.67 17.3,20.16 17.94,19.53 | LED7.A 30.96,20.8 30,19.84 23.34,19.84 23.02,19.53 18.57,19.53 | 18.57,19.53 17.94,19.53 | 17.94,19.53 18.57,19.53
BUS_PWR
  Top 0.406: LED8.A 22.48,21.97 JP4.22 JP4.21 | X6.7 52.86,11.91 54.13,10.64 62.39,10.64 X7.7
  Bottom 0.406: X6.7 31.91,10.64 31.59,10.64 24.29,10.64 17.62,17.3 17.62,22.38 18.57,23.34 | 18.57,23.34 JP4.21 19.21,23.34 18.57,23.34
CAN_H  (via drill 0.6)
  Top 0.406: v36.35,14.45 51.59,14.45 54.77,14.45 56.04,13.18 59.85,13.18 X7.5
  Top 0.61: U1.7 75.56,13.81 v76.04,13.34
  Bottom 0.406: v36.35,14.45 33.81,16.99 31.59,19.21 | 31.59,19.21 30,20.8 JP4.24 | JP6.2 31.59,19.21 | v76.04,13.34 73.34,10.64 63.02,10.64 62.23,10.64 61.12,11.75 X7.5
CAN_L  (via drill 0.6)
  Top 0.406: X7.4 58.58,15.72 55.4,15.72 v23.65,15.72 23.65,17.78 23.97,17.78 R39.1 | U1.6 v76.2,15.08
  Bottom 0.406: v23.65,15.72 23.34,16.03 JP4.26 | v76.2,15.08 74.77,15.08 72.87,13.18 60.96,13.18 59.85,14.29 X7.4
G0  (via drill 0.6)
  Top 0.406: LED1.A v40.16,37.31 LED2.C | OK1.2 13.02,44.93 v13.49,45.4
  Bottom 0.406: JP5.9 62.55,28.42 61.28,29.69 59.53,29.69 57.94,31.27 46.2,31.27 v40.16,37.31 38.89,38.58 38.89,52.55 37.94,53.5 P1_RA.PI.11 38.89,54.77 38.89,57.47 38.1,58.26 36.83,59.53 20,59.53 14.92,54.45 14.92,46.83 v13.49,45.4
G1  (via drill 0.6)
  Top 0.406: v7.3,24.92 7.3,24.61 7.3,23.81 IC1.3
  Bottom 0.406: JP4.11 16.03,39.21 16.03,43.5 | 16.03,43.5 16.03,53.82 20.48,58.58 35.08,58.58 37.62,56.36 P1_RA.PI.12 | 16.03,43.5 15.87,43.66 2.7,43.66 2.22,43.18 2.22,41.43 2.22,35.72 2.7,35.24 4.44,33.5 7.14,33.5 7.78,32.86 7.78,25.4 v7.3,24.92
G2  (via drill 0.6)
  Top 0.406: LED4.A v42.39,37.31 LED3.C | OK3.4 6.35,30.96 6.83,30.48 | 6.83,30.48 6.83,28.42 R47.1 | 6.83,30.48 v6.83,31.43 | v38.1,13.18 v49.37,13.18
  Bottom 0.406: P1_RA.PI.13 40.16,38.58 41.75,37.31 v42.39,37.31 47.47,32.23 58.26,32.23 58.58,32.23 59.69,31.12 60.64,31.12 JP5.12 60.96,30.8 61.44,30.8 62.23,30 62.55,29.69 63.98,29.69 64.13,29.53 64.61,29.05 64.61,27.62 64.45,27.46 64.13,27.15 60.17,27.15 59.21,26.19 59.21,25.56 49.37,15.72 v49.37,13.18 | v6.83,31.43 6.83,28.1 4.6,25.88 4.6,5.72 6.83,3.33 28.57,3.33 v38.1,13.18
G3  (via drill 0.6)
  Top 0.254: IC2.2 74.4,40.59 v74.14,40.32
  Top 0.406: LED5.C v44.61,37.31 LED9.A
  Bottom 0.254: P1_RA.PI.15 41.43,54.77 41.43,56.67 42.07,57.31 42.39,57.63 43.81,57.63 56.04,57.63 57.94,55.72 57.94,50.32 | v74.14,40.32 72.71,40.32 72.55,40.48 72.55,47.15 72.23,47.47 59.85,47.47 57.94,49.37 57.94,50.32 | 57.94,50.17 57.94,50.32
  Bottom 0.406: P1_RA.PI.15 42.7,38.58 43.97,37.31 v44.61,37.31 48.74,33.18 59.21,33.18 60.17,32.23 61.75,32.23 JP5.11
G4  (via drill 0.6)
  Top 0.254: IC2.4 75.72,41.67
  Top 0.406: LED11.A v46.83,37.31 LED10.C | 75.72,41.67 v75.72,40.32
  Bottom 0.254: v75.72,40.32 75.72,39.37 v75.72,40.32
  Bottom 0.406: P1_RA.PI.16 43.02,56.04 43.97,55.09 43.97,39.85 v46.83,37.31 50.01,34.13 59.53,34.13 60.17,33.5 JP5.14 61.59,33.5 63.02,32.23 64.45,32.23 65.25,31.43 65.25,25.24 69.53,21.11 74.93,21.11 75.72,21.91 75.72,38.89 v75.72,40.32
G5  (via drill 0.6)
  Top 0.254: 81.44,48.26 79.37,46.2 77.08,43.9 arc45 77,43.72 IC2.6 77,43.65 76.99,43.66 76.99,43.82 81.44,48.26 | 81.44,48.26 84.45,48.26 | 84.45,48.26 86.68,50.48 | 86.68,50.48 86.68,57.79 | 81.44,48.26 84.45,48.26 | 84.45,48.26 86.68,50.48 | 86.68,50.48 86.68,57.79 | 86.68,57.79 86.68,57.94 85.41,59.21 48.42,59.21 P1_RA.PI.18
  Top 0.406: LED12.C v49.05,37.31 49.05,36.04 LED13.A
  Bottom 0.406: P1_RA.PI.18 45.56,56.04 46.51,55.09 46.51,39.53 v49.05,37.31 51.28,35.08 59.53,35.08 59.85,34.77 61.75,34.77 63.02,33.5 JP5.13
G6  (via drill 0.6)
  Top 0.254: IC2.8 78.3,42.42 83.34,47.47 84.45,47.47 87.31,50.32 87.31,58.42 85.88,59.85 50.64,59.85 46.83,59.85 43.97,56.99 43.97,55.25 44.45,54.77 49.05,54.77 P1_RA.PI.22
  Top 0.406: LED15.A v51.28,37.31 LED14.C
  Bottom 0.406: P1_RA.PI.22 50.01,56.04 49.05,55.09 49.05,39.21 v51.28,37.31 52.55,36.04 58.58,36.04 59.85,37.31 61.75,37.31 JP5.15
G28  (via drill 0.6)
  Top 0.406: LED16.C v31.27,37.31 LED17.A | S5.4 S5.3 R33.1 | R33.1 C4.1 | S5.4 v55.4,27.15 | v25.56,27.15 v25.56,34.77 20.48,34.77 JP4.13 | S5.4 R33.1 | R33.1 v57.47,20.16 | IC2.9 78.95,41.17 v78.1,40.32
  Bottom 0.406: P5_RA.PI.3 32.23,50.96 31.27,50.01 v31.27,37.31 31.27,36.99 30,36.99 27.78,34.77 26.19,34.77 | v55.4,27.15 54.13,27.15 50.32,23.34 33.81,23.34 30,27.15 27.78,27.15 26.19,27.15 | 26.19,27.15 v25.56,27.15 26.19,27.15 | 26.19,34.77 v25.56,34.77 26.19,34.77 | v57.47,20.16 58.74,18.89 58.74,17.94 59.69,16.99 75.72,16.99 76.68,18.1 76.68,18.26 76.68,27.94 78.1,29.37 78.1,38.42 | 78.1,38.42 78.1,38.74 | 78.1,38.74 78.1,39.37 | v78.1,40.32 78.1,39.37 | 78.1,39.37 78.1,38.74 | 78.1,38.74 78.1,38.42
G29  (via drill 0.6)
  Top 0.254: IC2.7 77.65,43.2 v78.1,43.66
  Top 0.406: LED19.A v33.5,37.31 LED18.C | S4.4 S4.3 v47.78,27.15 | S4.4 R32.1 | S4.4 R32.1 | C1.1 47.47,20.16 | 47.47,20.16 R32.1 | R32.1 46.52,20.16 46.51,20.16 R32.1 | v24.29,28.42 v24.29,33.5 JP4.14 | v48.26,19.53 48.26,20.16 47.47,20.16
  Bottom 0.406: P5_RA.PI.4 32.54,38.26 v33.5,37.31 32.54,37.31 31.27,35.72 30.64,35.72 28.42,33.5 v24.29,33.5 | v47.78,27.15 45.24,24.61 34.45,24.61 30.64,28.42 v24.29,28.42 | v48.26,19.53 48.26,19.21 45.88,16.83 45.88,5.72 45.88,5.4 47.15,4.13 51.75,4.13 52.55,4.92 52.55,6.51 55.72,9.68 56.2,9.68 80.17,9.68 80.8,10.32 80.8,40.16 | 80.8,40.32 80.8,40.16 | v78.1,43.66 78.26,43.66 80.33,43.66 80.8,43.18 80.8,40.16
G30  (via drill 0.6)
  Top 0.254: IC2.5 76.35,42.55 v76.04,42.86
  Top 0.406: 35.72,36.04 v35.72,37.31 LED20.C | 35.72,36.04 LED21.A | LED21.A 35.72,35.72 | v43.97,27.15 S2.4 S2.3 R22.1 C16.1 43.49,20.16 43.5,20.16 v43.5,19.53 | LED21.A 35.72,36.04
  Bottom 0.406: 35.08,36.99 32.86,34.77 32.23,34.77 31.27,34.77 28.73,32.23 20.16,32.23 JP4.15 19.84,29.69 31.27,29.69 35.08,25.88 36.99,25.88 38.26,27.15 v43.97,27.15 | 35.08,36.99 v35.72,37.31 | P5_RA.PI.5 34.77,50.96 33.81,50.01 33.81,38.26 35.08,36.99 | v43.5,19.53 45.08,17.78 45.08,5.4 45.08,5.08 46.83,3.33 56.2,3.33 56.83,3.97 56.83,7.94 57.78,8.89 81.6,8.89 82.87,10.16 82.87,42.86 81.12,44.61 77.47,44.61 v76.04,42.86
G31  (via drill 0.6)
  Top 0.254: IC2.3 75.09,41.73 75.09,42.55 v74.77,42.86
  Top 0.406: LED23.A v37.62,37.31 LED22.C | 36.83,20.16 R21.1 S1.4 S1.3 v36.35,27.15 | 36.83,20.16 C15.1 | v36.83,19.53 36.83,20.16
  Bottom 0.406: JP4.16 29.05,30.96 31.59,33.5 33.81,33.5 | 33.81,33.5 37.31,36.99 v37.62,37.31 35.08,39.85 P5_RA.PI.6 | v36.35,27.15 36.35,30.96 33.81,33.5 | v36.83,19.53 37.31,18.89 42.07,18.89 44.29,16.99 44.29,4.92 44.29,4.76 46.35,2.7 46.51,2.54 56.67,2.54 57.63,3.49 57.63,7.46 58.26,8.1 59.53,8.1 81.91,8.1 83.66,9.84 83.66,43.34 81.6,45.4 76.36,45.4 75.41,44.29 74.77,43.5 v74.77,42.86
GCLK
  Bottom 0.406: JP4.12 21.43,36.35 23.65,38.58 23.65,39.85 23.65,40.16 25.56,42.07 25.56,48.42 29.37,52.23 30.96,52.23 P1_RA.PI.7
GND  (via drill 0.6)
  Top 0.254: IC2.19 74.45,47.47 74.45,46.51 74.29,46.36 68.9,46.36 68.42,46.83 67.79,46.83 C5.2 | IC2.1 73.02,41.12 73.02,39.53 74.45,39.06 C10.2 | IC2.10 79.6,38.26 79.85,38.26 C12.2 | C5.2 67.94,47.31 | 67.94,47.31 68.1,47.47 | C5.2 67.94,47.31
  Top 0.406: R1.1 R31.1 R29.1 R27.1 R25.1 31.27,27.78 R11.1 | R1.1 R6.1 R14.1 R16.1 R19.1 R23.1 | R1.1 40.16,28.42 | 40.16,28.42 40.16,27.15 | 40.16,27.15 S2.2 40.16,27.15 | 40.16,27.15 S1.1 40.16,27.15 | 40.16,27.15 40.16,22.07 | 40.16,22.07 S1.2 40.16,22.07 | S2.1 40.16,22.07 | 40.16,22.07 40.16,18.26 | 40.16,18.26 C15.2 | R12.1 R11.1 | R11.1 R8.1 | 40.16,18.26 C16.2 | 57.94,53.5 P1_RA.PI.25 | 23.65,57.63 28.42,57.63 | 40.16,56.36 P1_RA.PI.14 40.16,56.36 | 40.16,56.36 38.89,57.63 36.35,57.63 | 36.35,57.63 31.59,57.63 P1_RA.PI.6 30,56.36 28.73,57.63 23.65,57.63 | P1_RA.PI.20 48.74,56.99 50.01,58.26 56.04,58.26 56.67,58.26 58.1,56.83 | 57.94,53.5 57.94,56.36 57.94,56.67 58.1,56.83 | P5_RA.PI.8 P5_RA.PI.7 P1_RA.PI.9 35.08,53.82 36.35,55.09 36.35,57.63 | S5.2 51.59,27.15 | 51.59,27.15 S4.1 51.59,27.15 | R23.1 51.59,30.01 51.59,27.15 | 51.59,27.15 51.59,22.07 | S5.1 51.59,22.07 | 51.59,22.07 S4.2 | 51.59,22.07 S4.2 | S4.2 51.59,22.07 | 51.59,22.07 51.59,18.26 | 51.59,18.26 52.86,18.26 C4.2 51.59,18.26 | 51.59,18.26 C1.2 | R23.1 51.6,29.69 56.04,29.69 57.63,28.1 57.63,25.56 58.58,24.61 | 58.58,24.61 | v37.78,28.42 40.16,28.42 | 58.58,24.61 61.75,24.61 62.07,24.29 | 62.07,24.29 62.07,18.26 | JP5.1 63.02,18.26 | 63.02,18.26 62.07,18.26 | 62.07,18.26 JP5.2 | JP5.1 63.02,18.26 | 63.02,18.26 62.07,18.26 | 23.65,57.63 21.75,55.72 21.43,55.4 JP4.2 | JP4.2 21.11,48.74 | 21.11,48.74 JP4.1 | JP4.1 18.57,48.74 | JP5.1 63.02,18.26 | 64.93,15.72 X7.8 64.93,10.79 64.3,9.84 63.18,9.84 53.82,9.84 52.55,11.11 34.29,11.11 30.8,7.62 18.57,7.62 15.24,4.29 13.18,4.29 12.54,4.92 12.54,6.19 12.7,6.35 | 64.93,15.72 64.93,16.67 JP5.1 | 78.26,38.26 C10.2 74.13,38.57 74.14,38.58
  Top 0.406: 78.26,38.26 79.85,38.26 C12.2 | U$2.9 78.9,29.69 | 78.9,29.69 78.26,30.32 78.26,38.26 | C13.2 R38.1 69.38,11.59 70.17,10.8 v77.47,10.8 80.96,10.8 81.44,11.27 81.44,13.34 80.96,13.81 U1.2 | C13.2 C11.2 | 78.9,29.69 v79.53,29.05 | C13.2 64.93,15.72 | D5.1 71.92,52.39 71.75,52.55 71.75,56.04 | 71.75,56.04 71.44,56.36 C9.2 70.17,57.47 69.85,57.79 66.2,57.79 65.88,57.47 65.88,53.34 | C5.2 66.83,46.99 65.88,48.1 65.88,51.59 66.67,52.39 D6.1 66.52,52.39 65.88,53.02 65.88,53.34 | 71.75,56.04 71.75,57.79 71.75,57.94 72.23,58.42 74.61,58.42 75.25,57.79 C8.2 76.83,56.36 | D2.1 77.47,52.39 76.83,53.02 76.83,56.36 | 76.83,56.36 76.83,57.94 | D1.1 82.55,52.39 81.91,53.02 81.91,56.35 | 81.91,56.35 81.91,57.63 81.91,56.35 | C6.2 85.41,57.63 84.77,58.26 82.39,58.26 81.91,57.79 81.91,56.35 | 81.91,56.35 C7.2 80.49,56.51 80.49,57.94 80.01,58.42 77.31,58.42 76.83,57.94 | JP5.5 JP5.7 63.34,24.45 63.18,24.29 62.23,24.29 62.07,24.29 | 5.74,10.32 D3.A 6.03,13.63 IC1.5 6.03,20.96 | 5.74,10.32 R4.1 | 5.74,10.32 D4.A 5.87,7.17 5.87,6.19 6.67,5.4 | 5.74,10.32 R4.1 | R10.2 12.7,6.35 | 12.7,6.35 11.75,5.4 6.67,5.4 | 6.03,20.96 6.67,21.59 10.16,21.59 10.79,22.23 10.79,23.65 10.95,23.81 13.97,23.81 14.29,23.5 C3.2 | 6.03,20.96 3.49,23.5 3.49,32.54 4.44,33.5 OK3.3 4.44,33.97 JP3.1 2.06,39.21 2.06,44.93 3.65,46.51 5.87,48.74 JP4.1 | 57.94,53.5 57.94,53.34 65.88,53.34 | 76.83,56.36 76.83,57.94 | 58.1,56.83 v58.58,57.31 | JP4.2 21.11,48.74 | 62.07,18.26 JP5.2 | 62.07,18.26 JP5.2 | 62.07,18.26 JP5.2 | R48.1 6.67,3.49 6.67,5.4
  Bottom 0.406: P5_RA.PI.8 37.62,38.89 37.62,38.58 38.89,37.31 38.89,30.01 38.89,29.53 v37.78,28.42 | v79.53,29.05 77.47,26.99 v77.47,10.8 | v58.58,57.31 57.47,58.42 41.27,58.42 40.32,57.47 40.32,56.2 P1_RA.PI.14
  pour Bottom (isolate 0.356): 0.79,61.28 88.42,61.28 88.42,0.79 0.79,0.95
  pour Top (isolate 0.305): 0.79,61.28 88.42,61.28 88.42,0.79 0.79,0.79
GND_RS485
  Top 0.406: R10.1 15.24,6.35 17.62,8.73 29.37,8.73 31.91,11.27 31.91,12.7 X6.8
IN1  (via drill 0.6)
  Top 0.406: R34.1 83.66,56.67 v83.66,57.31
  Bottom 0.406: v83.66,57.31 78.74,52.39 67.47,52.39 66.83,52.39 66.04,51.59 63.5,48.9 JP5.25
IN2  (via drill 0.6)
  Top 0.406: R35.1 v78.26,57.47
  Bottom 0.406: v78.26,57.47 74.61,53.82 65.56,53.82 63.34,51.75 JP5.27
IN3  (via drill 0.6)
  Top 0.406: R36.1 v73.18,57.47
  Bottom 0.406: v73.18,57.47 71.12,55.09 65.88,55.09 64.93,55.09 JP5.28
IN4  (via drill 0.6)
  Top 0.406: R37.1 v66.99,56.35 v66.99,56.36
  Bottom 0.406: v66.99,56.36 63.5,56.36 59.37,52.55 59.37,50.64 | 59.37,50.64 59.37,50.48 59.37,50.17 | 59.37,50.17 59.37,50.64 | 59.37,50.64 59.37,50.17 | JP5.26 59.37,50.17
IN_1
  Top 0.406: R34.2 C6.1 85.4,54.44 D1.3 85.4,50.47 83.98,49.05 81.13,49.05 IC2.11
IN_2
  Top 0.254: IC2.13 78.26,47.56 | 80.64,50.96 80.32,51.29 D2.3
  Top 0.406: R35.2 C7.1 80.32,54.44 D2.3 | 78.26,47.56 78.26,48.42 78.9,49.05 79.69,49.05 80.49,49.85 80.64,50.01 80.64,50.96
IN_3
  Top 0.254: IC2.15 | 75.24,51.29 D5.3
  Top 0.406: R36.2 C8.1 75.24,54.44 D5.3 | IC2.15 76.99,49.53 75.24,51.29
IN_4
  Top 0.254: IC2.17 75.72,47.55 | 70.48,51.12 70.17,51.44 D6.3
  Top 0.406: R37.2 C9.1 70.16,54.44 D6.3 | 75.72,47.55 75.72,48.42 74.93,49.21 70.96,49.21 70.48,49.69 70.48,51.12
ISOL_IN+  (via drill 0.6)
  Top 0.406: R46.2 v13.33,28.73
  Bottom 0.406: v13.33,28.73 13.81,28.73 16.67,25.88 JP4.19
ISOL_IN-  (via drill 0.6)
  Top 0.406: OK3.2 12.86,33.5 v13.33,33.02
  Bottom 0.406: v13.33,33.02 17.94,28.42 JP4.17
ISOL_OUT1  (via drill 0.6)
  Top 0.406: OK1.4 7.3,40.01 R43.1 v7.3,40.96 | OK1.4 5.08,42.39 | OK1.4
  Bottom 0.406: JP4.18 20.16,27.15 17.3,27.15 11.91,32.54 11.91,33.5 14.6,36.2 14.6,39.37 13.02,40.96 v7.3,40.96
N$1
  Top 0.406: LED2.A R17.1
N$2
  Top 0.406: U1.8 R38.2
N$3
  Top 0.406: U$2.2 R40.1
N$4
  Top 0.254: R3.1 12.86,13.65 13.65,14.45 13.65,17.78 13.02,18.42 11.43,18.42 10.79,17.78 10.79,16.51 10.48,16.19 8.89,16.19 8.57,16.51 IC1.7
  Top 0.406: R4.2 9.81,10.32 D3.C 12.38,13.34 R3.1 R9.2
N$5
  Top 0.406: R1.2 LED1.C
N$6
  Top 0.406: R8.2 LED6.C
N$7
  Top 0.406: R11.2 LED7.C
N$8
  Top 0.406: R12.2 LED8.C
N$9
  Top 0.406: LED3.A R2.1
N$10
  Top 0.406: R6.2 LED4.C
N$11
  Top 0.406: LED5.A R7.1
N$12
  Top 0.406: R14.2 LED9.C
N$13
  Top 0.406: LED10.A R15.1
N$14
  Top 0.406: R16.2 LED11.C
N$15
  Top 0.406: R3.2 14.6,16.19 JP8.1
N$16
  Top 0.406: LED12.A R18.1
N$17
  Top 0.406: R19.2 LED13.C
N$18
  Top 0.406: LED14.A R20.1
N$19
  Top 0.406: R23.2 LED15.C
N$20
  Top 0.406: R24.1 LED16.A
N$21
  Top 0.406: R25.2 LED17.C
N$22
  Top 0.406: LED18.A R26.1
N$23
  Top 0.406: R27.2 LED19.C
N$24
  Top 0.406: LED20.A R28.1
N$25
  Top 0.406: R29.2 LED21.C
N$26
  Top 0.406: LED22.A R30.1
N$27
  Top 0.406: R31.2 LED23.C
N$28
  Top 0.406: R40.2 84.61,16.99 83.98,16.35 U1.4
N$29
  Top 0.406: U$2.1 80.17,19.53 77.31,16.67 77.31,12.86 77.63,12.54 U1.1
N$30
  Top 0.406: JP6.1 R39.2
N$31
  Top 0.406: U$2.8 83.66,28.42 84.3,29.05 84.3,32.86 83.98,33.18 82.45,33.18 Q1.2 81.82,33.75 81.91,33.66 | C12.1 81.75,33.82 81.76,33.81 | 81.76,33.81 81.91,33.66 | 81.91,33.66 81.76,33.81
N$32
  Top 0.406: U$2.7 79.85,27.15 73.18,33.81 72.23,33.81 Q1.1 72.23,33.88 72.23,38.26 C10.1
N$33
  Top 0.406: JP3.2 4.29,39.37 3.17,40.48 3.17,44.29 3.81,44.93 OK1.3
N$34
  Top 0.406: R42.1 9.37,39.84 OK1.1
N$35
  Top 0.406: R46.1 10,30.48 10.48,30.96 OK3.1
N$36  (via drill 0.6)
  Top 0.406: R43.2 7.3,36.51 v7.78,36.04
  Bottom 0.406: v7.78,36.04 8.1,35.72 10.95,35.72 JP2.1
N$37
  Top 0.406: U$2.6 81.9,24.78 82.07,24.61 U$2.5 U$2.4 84.29,23.34 R41.1
N$38
  Top 0.406: U$2.17 70.01,20.8 R44.1
N$39  (via drill 0.6)
  Top 0.406: R48.2 8.89,3.49 v9.68,4.29 | v8.89,24.92 8.73,24.92 8.57,24.77 8.57,23.81 | 8.57,23.81 8.57,23.5 | 8.57,23.5 IC1.2 | IC1.2 8.57,23.34 | 8.57,23.34 IC1.2 | IC1.2 8.57,23.5 | 8.57,23.5 8.57,23.81 | IC1.2 8.57,23.5 | 8.57,23.5 8.57,23.34
  Bottom 0.406: v9.68,4.29 9.68,23.97 9.68,24.13 v8.89,24.92
OUT1
  Top 0.254: IC2.18 75.09,47.49 75.09,46.51 75.09,46.2 74.61,45.72 63.82,45.72 JP5.23
OUT2  (via drill 0.6)
  Top 0.254: IC2.16 76.36,46.67 75.09,45.09 71.12,45.09 v70.8,44.77
  Bottom 0.254: v70.8,44.77 69.69,43.66 JP5.21
OUT3  (via drill 0.6)
  Top 0.254: IC2.14 77.63,47.5 77.63,46.83 75.56,44.45 71.91,44.45 70.8,43.34 70.8,42.55 v70.8,42.39
  Bottom 0.254: v70.8,42.39 69.53,41.12 JP5.19
OUT4  (via drill 0.6)
  Top 0.254: IC2.12 78.95,47.04 75.88,43.82 72.55,43.82 72.07,43.34 72.07,41.28 v70.8,40.01
  Bottom 0.254: v70.8,40.01 69.37,38.58 JP5.17
RESET_A
  Top 0.406: S3.3 S3.4 47.47,47.79 C2.1 51.27,47.79 52.86,46.2 52.86,35.08 52.86,34.13 60.8,26.19 JP5.8
  Bottom 0.406: JP5.8 60.8,24.92 50.96,15.08 50.96,10.48 52.23,9.21 52.55,8.89 52.55,7.62 JP1.2
RESET_B
  Top 0.406: S3.1 S3.2 47.47,49.69 C2.2 50.16,49.69 50.64,49.69 53.82,46.51 53.82,35.24 60.64,28.42 JP5.10
  Bottom 0.406: JP1.1 47.94,10.64 47.94,16.51 59.85,28.42 JP5.10
RS485_A
  Top 0.406: R5.1 15.87,8.41 17.3,9.84 28.73,9.84 30.64,11.75 X6.5
  Bottom 0.406: X6.5 29.37,13.18 28.73,13.18 24.29,13.18 20.16,17.3 20.16,19.53 JP4.23
RS485_A2  (via drill 0.6)
  Top 0.406: D4.C 9.84,7.3 11.27,8.73 v11.43,8.73 | v11.43,8.73 R5.2 v11.43,8.73 | JP8.2 12.06,16.51 11.11,15.56 8.41,15.56 8.25,15.56 7.3,16.51 IC1.6 | R13.1 v12.22,22.7
  Bottom 0.406: v11.43,8.73 11.43,15.56 JP8.2 12.22,16.67 v12.22,22.7
RS485_B
  Top 0.406: 28.42,13.18 X6.4 28.42,13.18 | 28.42,13.18 23.97,13.18 JP4.25 17.3,18.26 16.67,17.62 16.67,11.91 15.87,11.11 R9.1
RXD
  Top 0.406: IC1.1 9.84,24.92 10.64,25.72 15.72,25.72 16.35,26.35 16.35,37.15 17.62,38.42 18.73,38.42 JP4.9
  Bottom 0.406: JP4.9 16.99,40.8 16.99,53.18 21.11,57.63 33.81,57.63 35.08,56.36 P1_RA.PI.10
SCL0
  Bottom 0.406: JP4.10 21.43,39.21 24.61,42.39 24.61,48.74 29.37,53.5 P1_RA.PI.5
SDA0
  Bottom 0.406: JP4.8 22.07,41.12 23.02,42.07 23.34,42.39 23.65,42.7 23.65,44.93 23.65,49.69 P1_RA.PI.3
SPI_CE0_N  (via drill 0.6)
  Top 0.406: P1_RA.PI.24 53.82,55.09 54.13,54.77 54.13,51.28 57.78,47.47 57.78,46.36 JP5.22 | U$2.16 69.69,22.07 | 69.69,22.07 R45.1 69.69,22.07 | 69.69,22.07 v73.82,22.07
  Bottom 0.406: v73.82,22.07 74.61,22.86 74.77,23.02 74.77,24.92 74.77,25.08 74.14,25.72 67.63,25.72 66.83,26.51 66.83,36.35 65.88,37.31 62.86,37.31 62.07,38.1 62.07,42.39 JP5.22
SPI_CE1_N
  Top 0.406: U$2.12 69.53,27.15 69.21,27.46 68.58,28.1 68.58,44.29 67.94,44.93 62.07,44.93 JP5.24
  Bottom 0.406: P1_RA.PI.26 56.67,54.77 56.67,50.48 56.67,49.37 59.85,46.2 JP5.24
SPI_MISO
  Top 0.406: P1_RA.PI.21 50.32,52.55 55.72,47.15 55.72,42.86 JP5.18 62.07,37.31 65.88,37.31 66.83,36.35 66.83,27.15 70.64,23.34 U$2.15
SPI_MOSI  (via drill 0.6)
  Top 0.406: P1_RA.PI.19 48.1,53.5 54.77,46.83 54.77,41.12 JP5.16 | U$2.14 v73.66,24.61
  Bottom 0.406: v73.66,24.61 67.31,24.61 66.04,25.88 66.04,34.45 65.72,34.77 62.86,34.77 61.75,35.88 60.96,35.88 JP5.16
SPI_SCLK
  Top 0.406: P1_RA.PI.23 52.86,51.28 56.67,47.47 56.67,44.61 56.99,44.29 JP5.20 62.23,39.85 66.83,39.85 67.79,38.74 67.79,27.62 69.53,25.88 U$2.13
TXD
  Top 0.406: IC1.4 6.03,25.24 7.14,26.35 7.3,26.51 14.92,26.51 15.4,26.99 15.4,37.62 JP4.7
  Bottom 0.406: JP4.7 20.16,42.39 22.07,42.39 22.7,43.02 22.7,53.82 23.65,54.77 31.27,54.77 P1_RA.PI.8

### Text on the board
Top: Extension board | R.Pi ver. 1.00 | 25.01.2013
Reference: Extension board | IN2 | R.Pi ver. 1.00 | IN1 | OUT1 | 25.01.2013 | IN3 | GND | GND | IN4 | 5V0 | 3V3 | CE1 | 5V0 | 3V3 | CE0 | OUT2 | TXD | SDA | SCLK | OUT3 | RXD | SCL | MISO | OUT4 | G1 | CLK | MOSI | G6 | G28 | G29 | G4 | G5 | G30 | G31 | G2 | G3 | IO1 | IN- | RB | G0 | RA | IN+ | 3V3 | PWR | GND | 3V3 | C_H | C_L | PWR | A | B | RS485 | CAN